# EAGLE schematic mcu_sub (EAGLE 7.7.0)
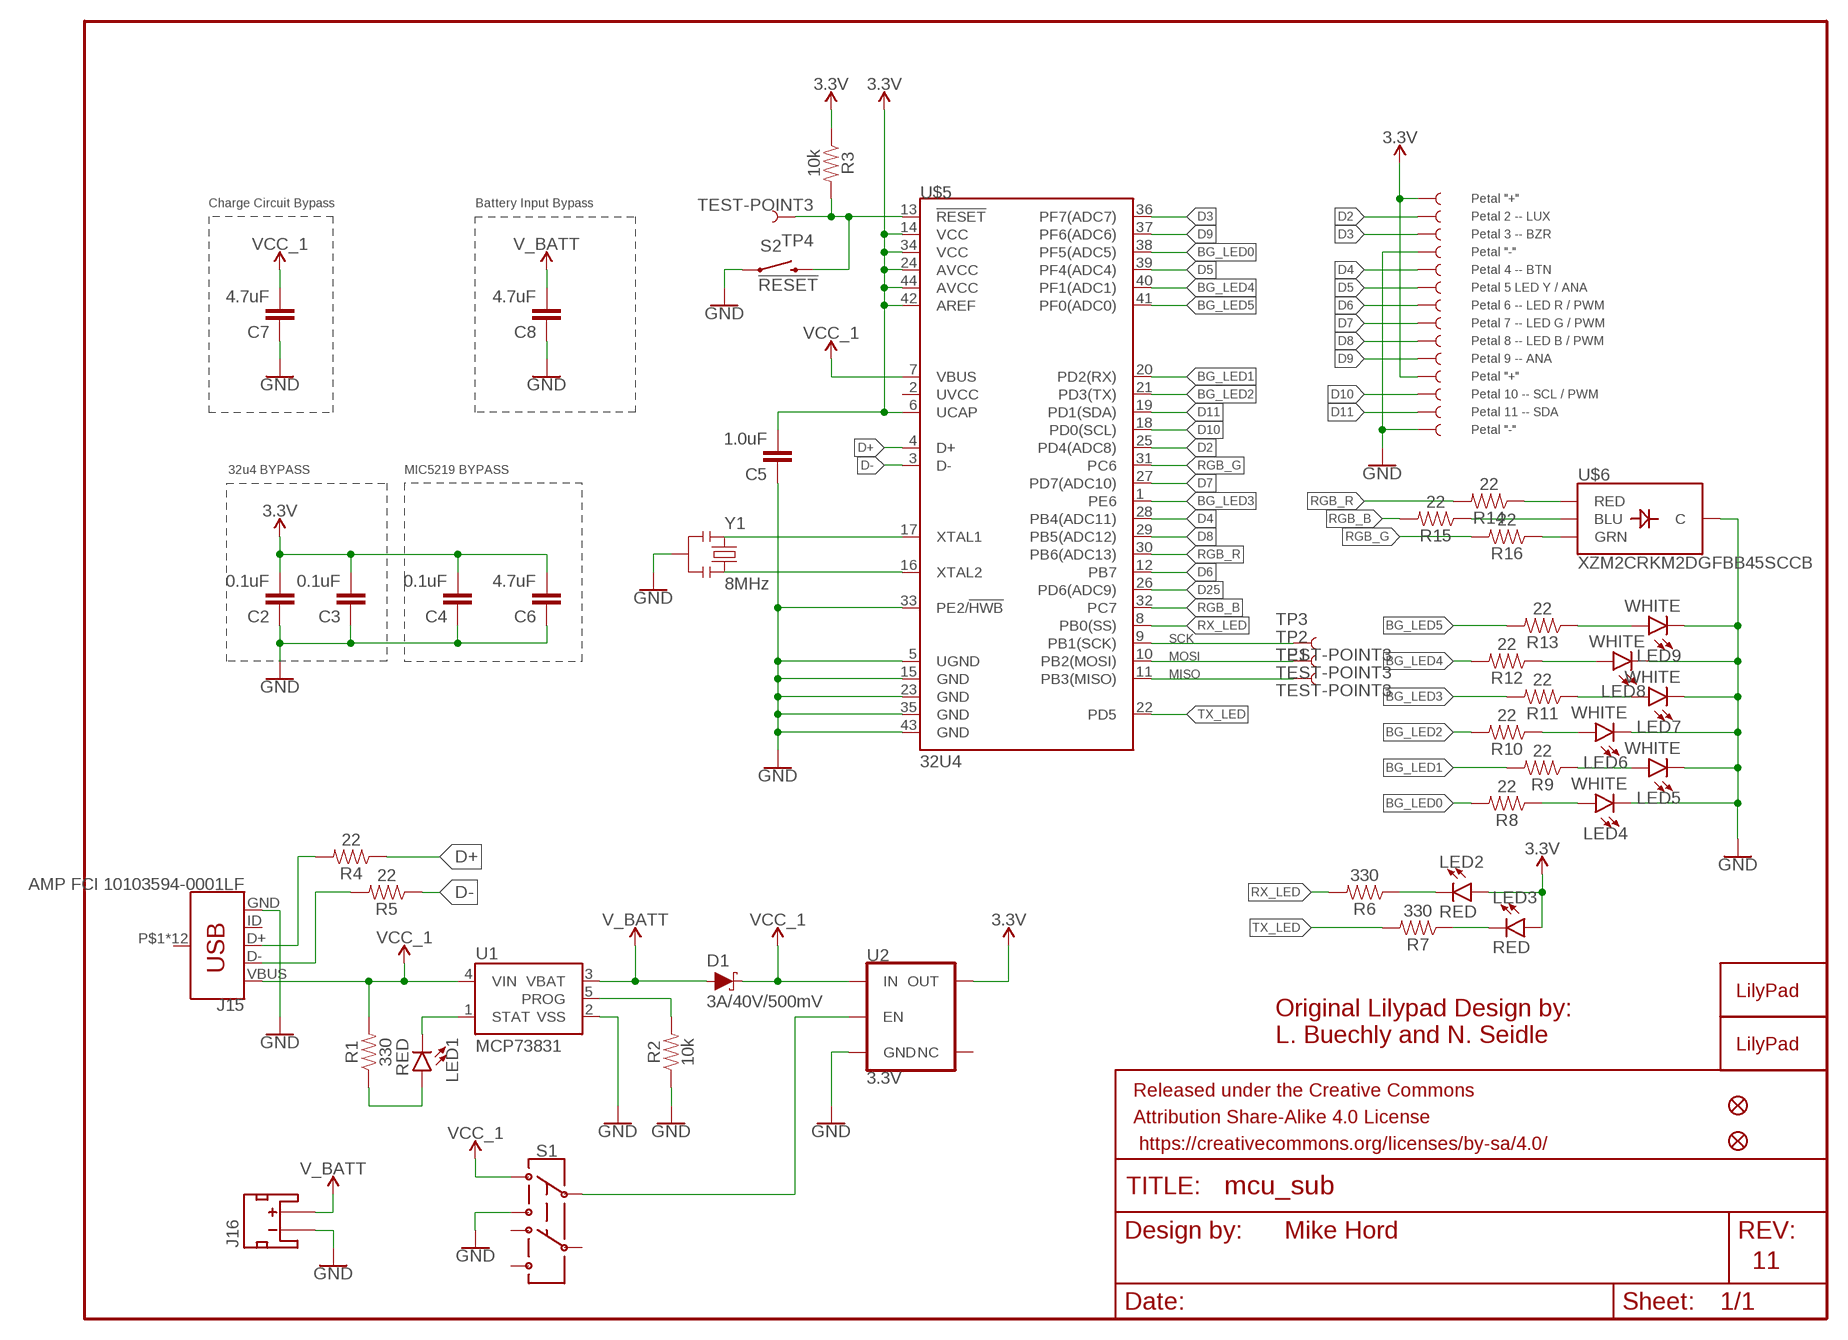
[diagram p0: schematic, sheet 1]

## Parts
C2  0.1uF  0.1UF-0402-16V-10%  [0402]
C3  0.1uF  0.1UF-0402-16V-10%  [0402]
C4  0.1uF  0.1UF-0402-16V-10%  [0402]
C5  1.0uF  1.0UF-0402-16V-10%  [0402]
C6  4.7uF  4.7UF0603  [0603]
C7  4.7uF  4.7UF0603  [0603]
C8  4.7uF  4.7UF0603  [0603]
D1  3A/40V/500mV  DIODE-SCHOTTKY-B340A  [SMA-DIODE]
FRAME1  FRAME-LETTER  [CREATIVE_COMMONS]
J1  SEWTAP_LONG  [PETAL-LONG-1]
J2  SEWTAP_LONG  [PETAL-LONG-1]
J3  SEWTAP_LONG  [PETAL-LONG-1]
J4  SEWTAP_LONG  [PETAL-LONG-1]
J5  SEWTAP_LONG  [PETAL-LONG-1]
J6  SEWTAP_LONG  [PETAL-LONG-1]
J7  SEWTAP_LONG  [PETAL-LONG-1]
J8  SEWTAP_LONG  [PETAL-LONG-1]
J9  SEWTAP_LONG  [PETAL-LONG-1]
J10  SEWTAP_LONG  [PETAL-LONG-1]
J11  SEWTAP_LONG  [PETAL-LONG-1]
J12  SEWTAP_LONG  [PETAL-LONG-1]
J13  SEWTAP_LONG  [PETAL-LONG-1]
J14  SEWTAP_LONG  [PETAL-LONG-1]
J15  AMP FCI 10103594-0001LF  USB_MICRO-B_HALF_PTH  [USB-MICROB-PTH]
J16  JST_2MM_MALE  [JST-2-SMD]
JP2  FIDUCIALUFIDUCIAL  [MICRO-FIDUCIAL]
JP3  FIDUCIALUFIDUCIAL  [MICRO-FIDUCIAL]
LED1  RED  LED-RED0603  [LED-0603]
LED2  RED  LED-RED0603  [LED-0603]
LED3  RED  LED-RED0603  [LED-0603]
LED4  WHITE  LED-WHITE0603  [LED-0603]
LED5  WHITE  LED-WHITE0603  [LED-0603]
LED6  WHITE  LED-WHITE0603  [LED-0603]
LED7  WHITE  LED-WHITE0603  [LED-0603]
LED8  WHITE  LED-WHITE0603  [LED-0603]
LED9  WHITE  LED-WHITE0603  [LED-0603]
R1  330  330OHM-0603-1/10W-1%  [0603]
R2  10k  10KOHM-0603-1/10W-1%  [0603]
R3  10k  10KOHM-0603-1/10W-1%  [0603]
R4  22  22OHM-0402-1/10W-1%  [0402]
R5  22  22OHM-0402-1/10W-1%  [0402]
R6  330  330OHM-0603-1/10W-1%  [0603]
R7  330  330OHM-0603-1/10W-1%  [0603]
R8  22  22OHM-0402-1/10W-1%  [0402]
R9  22  22OHM-0402-1/10W-1%  [0402]
R10  22  22OHM-0402-1/10W-1%  [0402]
R11  22  22OHM-0402-1/10W-1%  [0402]
R12  22  22OHM-0402-1/10W-1%  [0402]
R13  22  22OHM-0402-1/10W-1%  [0402]
R14  22  22OHM-0402-1/10W-1%  [0402]
R15  22  22OHM-0402-1/10W-1%  [0402]
R16  22  22OHM-0402-1/10W-1%  [0402]
S1  SWITCH-DPDT-SMD-AYZ0202  [SWITCH_DPDT_SMD_AYZ0202]
S2  !RESET  MOMENTARY-SWITCH-SPST-SMD-5.2-REDUNDANT  [TACTILE_SWITCH_SMD_5.2MM]
TP1  TEST-POINT3  [PAD.03X.03]
TP2  TEST-POINT3  [PAD.03X.03]
TP3  TEST-POINT3  [PAD.03X.03]
TP4  TEST-POINT3  [PAD.03X.03]
U1  MCP73831  [SOT23-5]
U2  3.3V  V_REG_AP2112K-3.3V  [SOT23-5]
U$1  LILYLOGO_LONG  [LILYPAD-WEARABLES_LOGO-LPA]
U$5  32U4  ATMEGA32U4_NOARDQFN  [QFN-44]
U$6  XZM2CRKM2DGFBB45SCCB  SUNLEDSMD1  [PLCC4SMDLED]
U$13  LILYLOGO_SHORT  [LILYPAD-WEARABLES_LOGO-LILYPAD]
Y1  8MHz  RESONATORSMD  [RESONATOR-SMD]

## Nets
3.3V: C2.2 C3.2 C4.2 C5.2 C6.2 J1.1 J11.1 LED2.A LED3.A R3.1 U2.5(OUT) U$5.6(UCAP) U$5.14(VCC) U$5.24(AVCC) U$5.34(VCC) U$5.42(AREF) U$5.44(AVCC)
BG_LED0: R8.2 U$5.38(PF5(ADC5))
BG_LED1: R9.2 U$5.20(PD2(RX))
BG_LED2: R10.2 U$5.21(PD3(TX))
BG_LED3: R11.2 U$5.1(PE6)
BG_LED4: R12.2 U$5.40(PF1(ADC1))
BG_LED5: R13.2 U$5.41(PF0(ADC0))
D2: J2.1 U$5.25(PD4(ADC8))
D3: J3.1 U$5.36(PF7(ADC7))
D4: J5.1 U$5.28(PB4(ADC11))
D5: J6.1 U$5.39(PF4(ADC4))
D6: J7.1 U$5.12(PB7)
D7: J8.1 U$5.27(PD7(ADC10))
D8: J9.1 U$5.29(PB5(ADC12))
D9: J10.1 U$5.37(PF6(ADC6))
D10: J12.1 U$5.18(PD0(SCL))
D11: J13.1 U$5.19(PD1(SDA))
D25: U$5.26(PD6(ADC9))
D+: R4.1 U$5.4(D+)
D-: R5.1 U$5.3(D-)
GND: C2.1 C3.1 C4.1 C5.1 C6.1 C7.1 C8.1 J4.1 J14.1 J15.GND J16.1(-) LED4.C LED5.C LED6.C LED7.C LED8.C LED9.C R2.1 S1.3 S2.1 S2.2 U1.2(VSS) U2.2(GND) U$5.5(UGND) U$5.15(GND) U$5.23(GND) U$5.33(PE2/!HWB) U$5.35(GND) U$5.43(GND) U$6.4(C) Y1.2
MISO: TP1.P$1 U$5.11(PB3(MISO))
MOSI: TP2.P$1 U$5.10(PB2(MOSI))
N$1: LED2.C R6.1
N$2: S1.2 U2.3(EN)
N$3: LED1.A R1.1
N$4: LED1.C U1.1(STAT)
N$5: U$5.17(XTAL1) Y1.1
N$6: R2.2 U1.5(PROG)
N$7: U$5.16(XTAL2) Y1.3
N$8: R16.1 U$6.2(GRN)
N$9: LED7.A R11.1
N$10: LED6.A R10.1
N$11: LED5.A R9.1
N$12: LED8.A R12.1
N$13: LED9.A R13.1
N$14: R15.1 U$6.3(BLU)
N$15: R14.1 U$6.1(RED)
N$18: LED4.A R8.1
N$19: J15.D- R5.2
N$20: J15.D+ R4.2
N$21: LED3.C R7.1
RESET: R3.2 S2.3 S2.4 TP4.P$1 U$5.13(!RESET)
RGB_B: R15.2 U$5.32(PC7)
RGB_G: R16.2 U$5.31(PC6)
RGB_R: R14.2 U$5.30(PB6(ADC13))
RX_LED: R6.2 U$5.8(PB0(SS))
SCK: TP3.P$1 U$5.9(PB1(SCK))
TX_LED: R7.2 U$5.22(PD5)
V_BATT: C8.2 D1.A J16.2(+) U1.3(VBAT)
VCC_1: C7.2 D1.C J15.VBUS R1.2 S1.1 U1.4(VIN) U2.1(IN) U$5.7(VBUS)
Unconnected: J15.ID J15.P$1(SHIELD) J15.P$2(SHIELD) J15.P$3(SHIELD) J15.P$4(SHIELD) J15.P$6(SHIELD) J15.P$8(SHIELD) J15.P$10(SHIELD) J15.P$12(SHIELD) J15.SHEILD2(SHIELD) J15.SHIELD J15.SHIELD3(SHIELD) J15.SHIELD4(SHIELD) J16.NC1(PAD1) J16.NC2(PAD2) S1.4 S1.5 S1.6 U2.4(NC) U$5.2(UVCC)

## Notes on the sheet
- Petal "+"
- Charge Circuit Bypass | Battery Input Bypass
- Petal 2 -- LUX
- Petal 3 -- BZR
- Petal "-"
- Petal 4 -- BTN
- Petal 5 LED Y / ANA
- Petal 6 -- LED R / PWM
- Petal 7 -- LED G / PWM
- Petal 8 -- LED B / PWM
- Petal 9 -- ANA
- Petal "+"
- Petal 10 -- SCL / PWM
- Petal 11 -- SDA
- Petal "-"
- 32u4 BYPASS | MIC5219 BYPASS
- Original Lilypad Design by:
- L. Buechly and N. Seidle
- Mike Hord
- 11

## Library data of the parts
C2-C4 = SparkFun-Capacitors:0.1UF: 0.1µF ceramic capacitors A capacitor is a passive two-terminal electrical component used to store electrical energy temporarily in an electric field.; PROD_ID: CAP-12416
C5 = SparkFun-Capacitors:1.0UF: 1µF ceramic capacitors A capacitor is a passive two-terminal electrical component used to store electrical energy temporarily in an electric field.; PROD_ID: CAP-12417
C6-C8 = SparkFun-Capacitors:4.7UF: 4.7µF ceramic capacitors A capacitor is a passive two-terminal electrical component used to store electrical energy temporarily in an electric field.; PROD_ID: CAP-08280
D1 = SparkFun-DiscreteSemi:DIODE-SCHOTTKY: Schottky diode A Schottky diode is a semiconductor diode which has a low forward voltage drop and a very fast switching action.; PROD_ID: DIO-09886
FRAME1 = SparkFun-Aesthetics:FRAME-LETTER: Schematic Frame - Letter Standard 8.5x11 US Letter frame
J1-J14 = LilyPad-Wearables:SEWTAP: SparkFun LilyPad Sew Taps Sewable connection points for LilyPad Boards SparkFun Products: LilyPad Arduino 328 Main Board <https://www.sparkfun.com/products/13342> LilyTiny <https://www.sparkfun.com/products/10899> LilyPad Power Supply <https://www.sparkfun.com/products/11259>
J15 = SparkFun-Connectors:USB_MICRO-B: USB Type Micro-B Connector Male/female and PTH/SMT variants SparkFun Products: SparkFun microB USB Breakout <https://www.sparkfun.com/products/12035> SparkFun USB microB Plug Breakout <https://www.sparkfun.com/products/10031> SparkFun ESP8266 Thing <https://www.sparkfun.com/products/13231>; PROD_ID: CONN-13711
J16 = SparkFun-Connectors:JST_2MM_MALE: JST 2MM MALE RA CONNECTOR Two pin, compact surface mount connector. Commonly used as a battery input connection point. We really like the solid locking feeling and high current rating on these small connectors. We use these all the time as battery connectors. Mates to single-cell LiPo batteries. Here is the connector we sell at SparkFun: JST Right Angle Connector - White <https://www.sparkfun.com/products/8612> (PRT-08612) Datasheet <http://www.sparkfun.com/datasheets/Prototyping/Connectors/JST-Horizontal.pdf> It was used on these SparkFun products: SparkFun MOSFET Power Controller <https://www.sparkfun.com/products/11214> (PRT-11214) SparkFun Battery Babysitter - LiPo Battery Manager <https://www.sparkfun.com/products/13777> (PRT-13777) And many, many others that required a lipo battery connection.; PROD_ID: CONN-11443; SF_ID: PRT-08612
JP2 JP3 = SparkFun:FIDUCIAL: Fiducial Alignment Points Various fiducial points for machine vision alignment.
LED1-LED3 = SparkFun-LED:LED-RED: Red SMD LED Used in manufacturing of most products at SparkFun Packages: 0603 - SMD 0603 package [Product Link] <http://docs.avagotech.com/docs/AV02-0551EN> 0603 SMART - SMD 0603 SMART package ( more efficient and expensive)[Product Link] <http://www.osram-os.com/Graphics/XPic2/00077099_0.pdf> 1206 - SMD1206 package [Product Link] <https://www.sparkfun.com/datasheets/DevTools/LilyPad/Q150OVS4.pdff> SparkFun Products: Pro Mini 328 -5V <https://www.sparkfun.com/products/821> RedBoard <https://www.sparkfun.com/products/12757> IOIO-OTG <https://www.sparkfun.com/products/13613>; PROD_ID: DIO-00819
LED4-LED9 = SparkFun-LED:LED-WHITE: White SMD LED Used in manufacturing several products at SparkFun. Packages: 0603 - Bright White SMD 0603 package[Product Link] <http://www.kingbrightusa.com/product.asp?catalog_name=LED&product_id=APT1608QWF/D> 1206 - Bright White SMD1206 package [Product Link] <http://www.kingbrightusa.com/product.asp?catalog_name=LED&product_id=APT3216QWF/D> SparkFun Products: Blackberry Trackballer Breakout <https://www.sparkfun.com/products/13169> Digital SandBox <https://www.sparkfun.com/products/12651>; PROD_ID: DIO-09004
R1 R6 R7 = SparkFun-Resistors:330OHM: 330Ω resistor A resistor is a passive two-terminal electrical component that implements electrical resistance as a circuit element. Resistors act to reduce current flow, and, at the same time, act to lower voltage levels within circuits. - Wikipedia; PROD_ID: RES-00818
R2 R3 = SparkFun-Resistors:10KOHM: 10kΩ resistor A resistor is a passive two-terminal electrical component that implements electrical resistance as a circuit element. Resistors act to reduce current flow, and, at the same time, act to lower voltage levels within circuits. - Wikipedia; PROD_ID: RES-00824
R4 R5 R8-R16 = SparkFun-Resistors:22OHM: 22Ω resistor A resistor is a passive two-terminal electrical component that implements electrical resistance as a circuit element. Resistors act to reduce current flow, and, at the same time, act to lower voltage levels within circuits. - Wikipedia; PROD_ID: RES-12427
S1 = SparkFun-Switches:SWITCH-DPDT: Double-Pole, Double-Throw (DPDT) Switch Double-pole, double-throw switches. Variant Overview PTH-GPI-152-3013 Used on SparkFun Geiger Counter <https://www.sparkfun.com/products/11345> SMD-AY0202 Surface Mount DPDT Switch <https://www.sparkfun.com/products/597> (COM-00597) Used on e.g. LilyPad Arduino USB - ATmega32U4 Board <https://www.sparkfun.com/products/12049>; PROD_ID: SWCH-08179; SF_SKU: COM-00597
S2 = SparkFun-Switches:MOMENTARY-SWITCH-SPST: Momentary Switch (Pushbutton) - SPST Normally-open (NO) SPST momentary switches (buttons, pushbuttons). Variants PTH-12MM - 12mm square, through-hole Momentary Pushbutton Switch - 12mm Square <https://www.sparkfun.com/products/9190> (COM-09190) PTH-6.0MM, PTH-6.0MM-KIT - 6.0mm square, through-hole Mini Pushbutton Switch <https://www.sparkfun.com/products/97> (COM-00097) KIT package intended for soldering kit's - only one side of pads' copper is exposed. PTH-RIGHT-ANGLE-KIT - Right-angle, through-hole Right Angle Tactile Button <https://www.sparkfun.com/products/10791> - Used on SparkFun BigTime Watch Kit <https://www.sparkfun.com/products/11734> SMD-12MM - 12mm square, surface-mount Tactile Button - SMD (12mm) <https://www.sparkfun.com/products/12993> (COM-12993) Used on SparkFun PicoBoard <https://www.sparkfun.com/products/11888> SMD-4.5MM - 4.5mm Square Trackball Switch Used on SparkFun Blackberry Trackballer Breakout <https://www.sparkfun.com/products/13169> SMD-4.6MMX2.8MM - 4.60mm x 2.80mm, surface mount Used on SparkFun SAMD21 Mini Breakout <https://www.sparkfun.com/products/13664> SMD-5.2MM, SMD-5.2-REDUNDANT - 5.2mm square, surface-mount Mini Pushbutton Switch - SMD <https://www.sparkfun.com/products/8720> (COM-08720) Used on Arduino Pro Mini <https://www.sparkfun.com/products/11114> REDUNDANT package connects both switch circuits together SMD-6.0X3.5MM - 6.0 x 3.5mm, surface mount Momentary Reset Switch SMD <https://www.sparkfun.com/products/8229> (COM-08229) SMD-6.2MM-TALL - 6.2mm square, surface mount Tactile Button - SMD (6mm) <https://www.sparkfun.com/products/12992> Used on SparkFun Digital Sandbox <https://www.sparkfun.com/products/12651> SMD-RIGHT-ANGLE - Right-angle, surface mount Used on SparkFun Block for Intel® Edison - Arduino <https://www.sparkfun.com/products/13036>; PROD_ID: SWCH-08247; SF_SKU: COM-08720
TP1-TP4 = SparkFun-Connectors:TEST-POINT: SparkFun Test Points Bare copper test points for troubleshooting or In-Circuit-Testing. These are used by our Production team for verifying production board runs using pogo-pins on test beds. SparkFun Products: SparkFun LSM9DS1 Breakout <https://www.sparkfun.com/products/13284> SparkFun PSOC <https://www.sparkfun.com/products/13714> SparkFun Load Cell Amplifier <https://www.sparkfun.com/products/13879>
U1 = SparkFun-PowerIC:MCP73831: Miniature single cell, fully integrated Li-Ion, Li-polymer charge management controller http://ww1.microchip.com/downloads/en/DeviceDoc/21984a.pdf; PROD_ID: IC-09995
U2 = SparkFun-IC-Power:V_REG_AP2112: AP2112 - 600mA CMOS LDO Regulator w/ Enable The AP2112 is CMOS process low dropout linear regulator with enable function, the regulator delivers a guaranteed 600mA (min.) continuous load current. Features Output Voltage Accuracy: ±1.5% Output Current: 600mA (Min.) Foldback Short Current Protection: 50mA Enable Function to Turn ON/OFF VOUT Low Dropout Voltage (3.3V): 250mV (Typ.) @IOUT=600mA Excellent Load Regulation: 0.2%/A (Typ.) Excellent Line Regulation: 0.02%/V (Typ.) Low Quiescent Current: 55μA (Typ.) Low Standby Current: 0.01μA (Typ.) Low Output Noise: 50μVRMS PSRR: 100Hz -65dB, 1kHz -65dB OTSD Protection Stable with 1.0μF Flexible Cap: Ceramic, Tantalum and Aluminum Electrolytic Operation Temperature Range: -40°C to 85°C ESD: MM 400V, HBM 4000V; PROD_ID: VREG-12457
U$1 = newLilypadParts:LILYLOGO_LONG
U$5 = newLilypadParts:ATMEGA32U4_NOARD: Atmel MCU, 32KByte Atmel 44-pin 8-bit Microcontroller with 32KBytes of ISP Flash and USB Controller Datasheet <http://cdn.sparkfun.com/datasheets/Dev/Arduino/Boards/ATMega32U4.pdf> SparkFun Products LilyPad Arduino USB - ATmega32U4 Board <https://www.sparkfun.com/products/12049> (DEV-12049) Pro Micro - 5V/16MHz <https://www.sparkfun.com/products/12640> (DEV-12640) Pro Micro - 3.3V/8MHz <https://www.sparkfun.com/products/12587> (DEV-12587) Fio v3 - ATmega32U4 <https://www.sparkfun.com/products/11520> (DEV-11520) Qduino Mini <https://www.sparkfun.com/products/13614> (DEV-13614) Makey Makey - Standard Kit <https://www.sparkfun.com/products/11511> (WIG-11511) Makey Makey Deluxe Kit <https://www.sparkfun.com/products/11519> (WIG-11519); PROD_ID: IC-10828
U$6 = newLilypadParts:SUNLED: LED-RGB Common Cathode XZM2CRKM2DGFBB45SCCB Packages: PLCC4 SparkFun Products: Lilypad Prototyping Board <[https://www.sparkfun.com/products/9264]>; PROD_ID: NEW-XXXXX
U$13 = newLilypadParts:LILYLOGO_SHORT
Y1 = SparkFun-FreqCtrl:RESONATOR: Resonator Small SMD resonator. This is the itty bitty 10/20MHz resonators with built in caps. CSTCE10M0G55 and CSTCE20M0V53. Footprint has been reviewed closely but hasn't been tested yet.; PROD_ID: XTAL-08895